# Altium project HealthSensors.PrjPcb
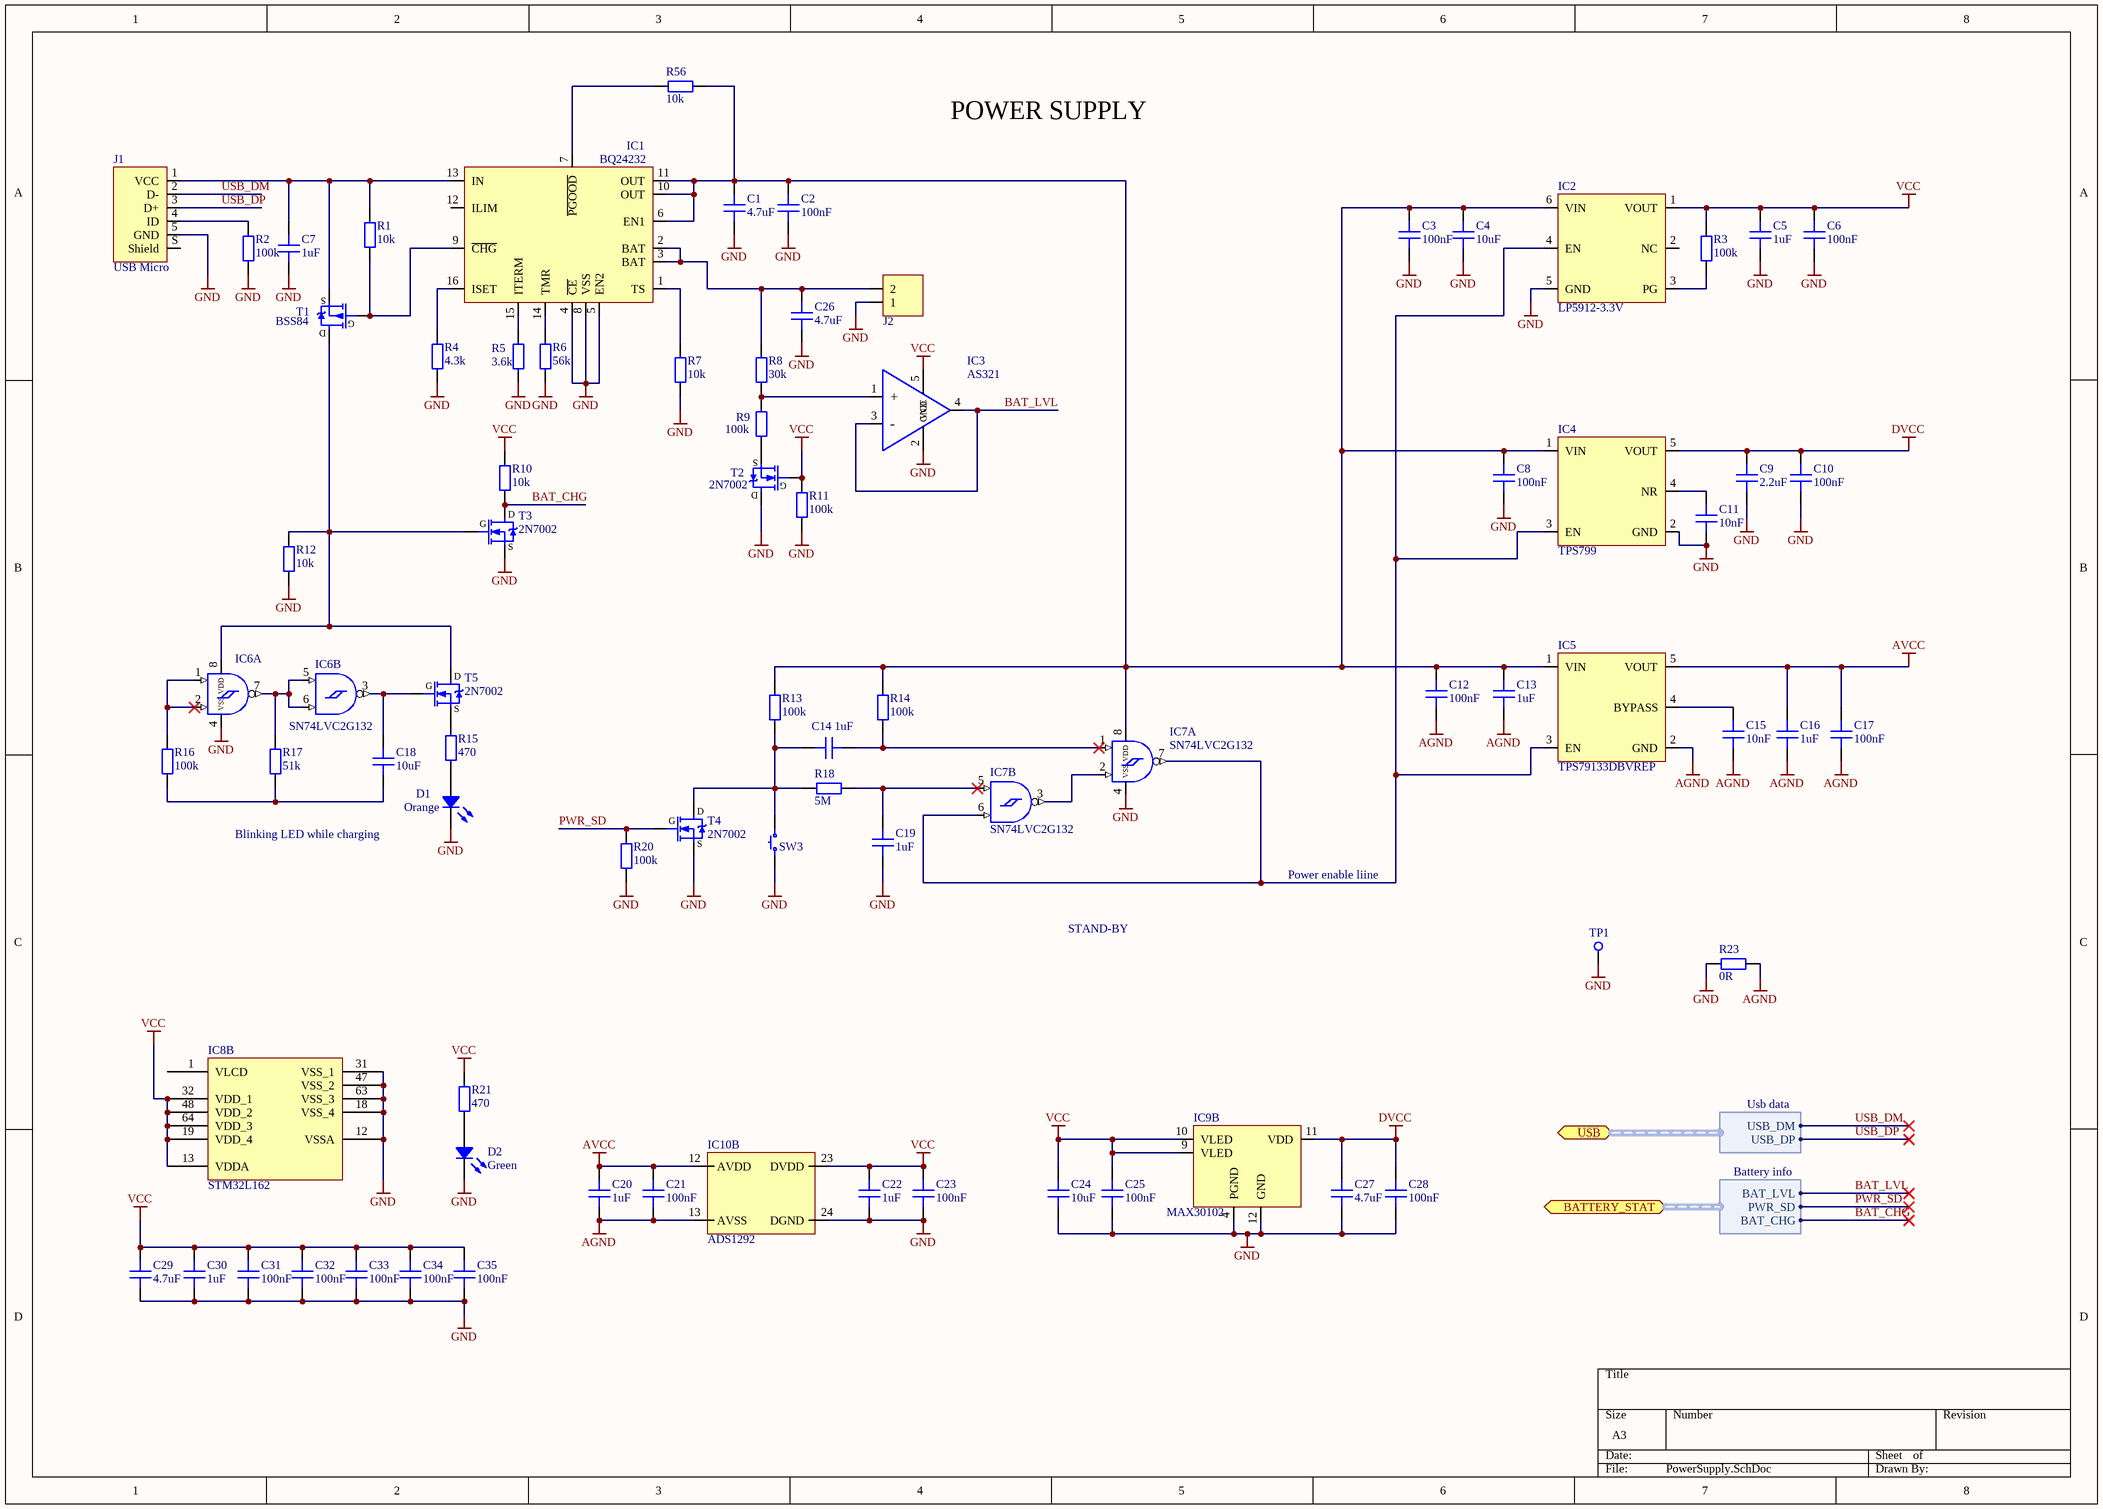
[diagram p0: PowerSupply.SchDoc]
4 sheets, 154 parts. Net scope: flat (ports and power ports of the same name join across sheets).
Board file: HealthSensors.PcbDoc
Sheets:
  PowerSupply.SchDoc
  ControlUnit.SchDoc
  Measurements.SchDoc
  Wireless.SchDoc

## Sheet PowerSupply.SchDoc
size A3

### Parts
C1  4.7uF  [CAP 0603]
C2  100nF  [CAP 0603]
C3  100nF  [CAP 0603]
C4  10uF  [CAP 0603]
C5  1uF  [CAP 0603]
C6  100nF  [CAP 0603]
C7  1uF  [CAP 0603]
C8  100nF  [CAP 0603]
C9  2.2uF  [CAP 0603]
C10  100nF  [CAP 0603]
C11  10nF  [CAP 0603]
C12  100nF  [CAP 0603]
C13  1uF  [CAP 0603]
C14  1uF  [CAP 0603]
C15  10nF  [CAP 0603]
C16  1uF  [CAP 0603]
C17  100nF  [CAP 0603]
C18  10uF  [CAP 0603]
C19  1uF  [CAP 0603]
C20  1uF  [CAP 0603]
C21  100nF  [CAP 0603]
C22  1uF  [CAP 0603]
C23  100nF  [CAP 0603]
C24  10uF  [CAP 0603]
C25  100nF  [CAP 0603]
C26  4.7uF  [CAP 0603]
C27  4.7uF  [CAP 0603]
C28  100nF  [CAP 0603]
C29  4.7uF  [CAP 0603]
C30  1uF  [CAP 0603]
C31  100nF  [CAP 0603]
C32  100nF  [CAP 0603]
C33  100nF  [CAP 0603]
C34  100nF  [CAP 0603]
C35  100nF  [CAP 0603]
D1  Orange  [LED 0603]
D2  Green  [LED 0603]
IC1  BQ24232  [QFN16]
IC2  LP5912-3.3V  [WSON 6]
IC3  AS321  [SOT23, 5-Leads]
IC4  TPS799  [SOT23, 5-Leads]
IC5  TPS79133DBVREP  [SOT23, 5-Leads]
IC6  SN74LVC2G132  [TSSOP8]  (parts A,B of 2)
IC7  SN74LVC2G132  [TSSOP8]  (parts A,B of 2)
IC8  STM32L162  [LQFP64_L]  (part B of 3)
IC9  MAX30102  [MAX30102]  (part B of 2)
IC10  ADS1292  [TQFP40]  (part B of 2)
J1  USB Micro  [FCI USB 10118193-0001LF]
J2  2 pin  [HDR 1x2 2.54]  (value not drawn)
R1  10k  [RES 0603]
R2  100k  [RES 0603]
R3  100k  [RES 0603]
R4  4.3k  [RES 0603]
R5  3.6k  [RES 0603]
R6  56k  [RES 0603]
R7  10k  [RES 0603]
R8  30k  [RES 0603]
R9  100k  [RES 0603]
R10  10k  [RES 0603]
R11  100k  [RES 0603]
R12  10k  [RES 0603]
R13  100k  [RES 0603]
R14  100k  [RES 0603]
R15  470  [RES 0603]
R16  100k  [RES 0603]
R17  51k  [RES 0603]
R18  5M  [RES 0603]
R20  100k  [RES 0603]
R21  470  [RES 0603]
R23  0R  [RES 0603]
R56  10k  [RES 0603]
SW3  BUTTON-NO  [SW OMRON]  (value not drawn)
T1  BSS84  [SOT23]
T2  2N7002  [SOT23]
T3  2N7002  [SOT23]
T4  2N7002  [SOT23]
T5  2N7002  [SOT23]
TP1  Test Point  [TP THT 48MILS]  (value not drawn)

### Ports
BATTERY_STAT (harness Battery info), USB (harness Usb data)

### Harnesses
Battery info: BAT_LVL, PWR_SD, BAT_CHG
Usb data: USB_DM, USB_DP

### Nets
AGND: C12.1 C13.1 C15.1 C16.1 C17.1 C20.1 C21.1 IC5.2(GND) IC10.13(AVSS) R23.1
AVCC: C16.2 C17.2 C20.2 C21.2 IC5.5(VOUT) IC10.12(AVDD)
DVCC: C9.2 C10.2 C27.2 C28.2 IC4.5(VOUT) IC9.11(VDD)
GND: C1.1 C2.1 C3.1 C4.1 C5.1 C6.1 C7.1 C8.1 C9.1 C10.1 C11.1 C19.1 C22.1 C23.1 C24.1 C25.1 C26.1 C27.1 C28.1 C29.1 C30.1 C31.1 C32.1 C33.1 C34.1 C35.1 D1.2 D2.2 IC1.4(~{CE}) IC1.5(EN2) IC1.8(VSS) IC2.5(GND) IC3.2(GND) IC4.2(GND) IC6.4(VSS) IC7.4(VSS) IC8.12(VSSA) IC8.18(VSS_4) IC8.31(VSS_1) IC8.47(VSS_2) IC8.63(VSS_3) IC9.4(PGND) IC9.12(GND) IC10.24(DGND) J1.5(GND) J2.1 R2.1 R4.1 R5.1 R6.1 R7.1 R11.1 R12.1 R20.1 R23.2 SW3.2 T2.3(D) T3.2(S) T4.2(S) TP1.1(TP)
VCC: C5.2 C6.2 C22.2 C23.2 C24.2 C25.2 C29.2 C30.2 C31.2 C32.2 C33.2 C34.2 C35.2 IC2.1(VOUT) IC3.5(VCC) IC8.13(VDDA) IC8.19(VDD_4) IC8.32(VDD_1) IC8.48(VDD_2) IC8.64(VDD_3) IC9.9(VLED) IC9.10(VLED) IC10.23(DVDD) R3.2 R10.2 R11.2 R21.2 T2.1(G)
BAT_CHG: R10.1 T3.3(D) ; port BATTERY_STAT.BAT_CHG
BAT_LVL: IC3.3(-) IC3.4(OUT) ; port BATTERY_STAT.BAT_LVL
PWR_SD: R20.2 T4.1(G) ; port BATTERY_STAT.PWR_SD
USB_DM: J1.2(D-) ; port USB.USB_DM
USB_DP: J1.3(D+) ; port USB.USB_DP
NetC1_2: C1.2 C2.2 C3.2 C4.2 C8.2 C12.2 C13.2 IC1.6(EN1) IC1.10(OUT) IC1.11(OUT) IC2.6(VIN) IC4.1(VIN) IC5.1(VIN) IC7.8(VDD) R13.2 R14.2 R56.2
NetC7_2: C7.2 IC1.13(IN) J1.1(VCC) R1.2 T1.3(S)
NetC11_2: C11.2 IC4.4(NR)
NetC14_1: C14.1 R13.1 R18.2 SW3.1 T4.3(D)
NetC14_2: C14.2 IC7.1(A) R14.1
NetC15_2: C15.2 IC5.4(BYPASS)
NetC18_1: C18.1 R16.1 R17.1
NetC18_2: C18.2 IC6.3(Y) T5.1(G)
NetC19_2: C19.2 IC7.5(A) R18.1
NetC26_2: C26.2 IC1.2(BAT) IC1.3(BAT) J2.2 R8.2
NetD1_1: D1.1 R15.1
NetD2_1: D2.1 R21.1
NetIC1_1: IC1.1(TS) R7.2
NetIC1_7: IC1.7(~{PGOOD}) R56.1
NetIC1_9: IC1.9(~{CHG}) R1.1 T1.1(G)
NetIC1_14: IC1.14(TMR) R6.2
NetIC1_15: IC1.15(ITERM) R5.2
NetIC1_16: IC1.16(ISET) R4.2
NetIC2_3: IC2.3(PG) R3.1
NetIC2_4: IC2.4(EN) IC4.3(EN) IC5.3(EN) IC7.6(B) IC7.7(Y)
NetIC3_1: IC3.1(+) R8.1 R9.2
NetIC6_1: IC6.1(A) IC6.2(B) R16.2
NetIC6_5: IC6.5(A) IC6.6(B) IC6.7(Y) R17.2
NetIC6_8: IC6.8(VDD) R12.2 T1.2(D) T3.1(G) T5.3(D)
NetIC7_2: IC7.2(B) IC7.3(Y)
NetJ1_4: J1.4(ID) R2.2
NetR9_1: R9.1 T2.2(S)
NetR15_2: R15.2 T5.2(S)

Not connected (* = marked no-connect by the designer): IC1 12(ILIM); IC2 2(NC); IC8 1(VLCD); J1 S(Shield)

### Notes on the sheet
- POWER SUPPLY
- Blinking LED while charging
- Power enable liine
- STAND-BY

### Library data of the parts
C1-C35 = Capacitor: SMT Capacitor
  C1 C26 C27 C29: Value: 4.7uF
  C2 C3 C6 C8 C10 C12 C17 C21 C23 C25 C28 C31-C35: Value: 100nF
  C4 C18 C24: Value: 10uF
  C5 C7 C13 C14 C16 C19 C20 C22 C30: Value: 1uF
  C9: Value: 2.2uF
  C11 C15: Value: 10nF
D1 D2 = LED: Chip LED
  D1: Value: Orange
  D2: Value: Green
IC1 = TI BQ24232: USB Friendly 0.5A Li+ Charger w/ Dynamic Power Management
IC2 = TI LP5912-3.3V: 50 mA, 3 V TO 50 V, MICROPOWER, LOW-DROPOUT LINEAR REGULATOR
IC3 = AS321: Op amp
IC4 = TI TPS799: TPS799 200-mA, Low-Quiescent Current, Ultralow Noise, High-PSRR Low-Dropout Linear  Regulator
IC5 = TI TPS79133DBVREP: ULTRALOW NOISE, HIGH PSRR, FAST RF, 100-mA  LOW-DROPOUT LINEAR REGULATORS
IC6 IC7 = SN74LVC2G132: Dual 2-Input NAND Gate With Schmitt-Trigger Inputs; Value: SN74LVC2G132
IC8 = STM32L162: STM32 ARM-based 32-bit MCU with 32 Kbytes Flash, 64-pin LQFP; Value: STM32L162RDT; ComponentLink1Description: http://www.st.com/content/ccc/resource/technical/document/datasheet/ee/d5/84/2b/a9/ae/44/3d/DM00039232.pdf/files/DM00039232.pdf/jcr:content/translations/en.DM00039232.pdf; ComponentLink1URL: http://www.st.com/stonline/products/literature/ds/13586.pdf; Package: LQFP64
IC9 = MAX30102: Pulse Oximeter and Heart-Rate Sensor
IC10 = ADS1292IRSMT: ADS1292IRSMT Analog Front End - AFE Cmplt Lw Pwr Intgrtd AFE for ECG apps; Manufacture: Texas Instruments; SNR - Signal to Noise Ratio: 107 dB; Package/Cas: VQFN-32; Supply Voltage - Min - Max: 2.7V - 5.25V; Operating Supply Curren: 750 uA; Operating Supply Voltage: 1.7 V to 3.6 V, 2.7 V to 5.25 V; Product Category: Analog Front End - AFE; Series: ADS1292; DatasheetURL: http://www.ti.com/lit/ds/symlink/ads1292.pdf; StoreURL: http://pl.mouser.com/Search/ProductDetail.aspx?R=ADS1292IRSMTvirtualkey59500000virtualkey595-ADS1292IRSMT
J1 = USB 2.0 Type B Micro: Micro usb
J2 = 2 pin: 2 pin header, male
R1-R18 R20 R21 R23 R56 = Resistor: SMDResistor
  R1 R7 R10 R12 R56: Value: 10k
  R2 R3 R9 R11 R13 R14 R16 R20: Value: 100k
  R4: Value: 4.3k
  R5: Value: 3.6k
  R6: Value: 56k
  R8: Value: 30k
  R15 R21: Value: 470
  R17: Value: 51k
  R18: Value: 5M
  R23: Value: 0R
SW3 = BUTTON-NO 2 PIN Small: Button, SMD, Small, 2.5x3mm
T1 = P-MOSFET: Unipolar transistor P-MOSFET; Value: BSS84
T2-T5 = N-MOSFET: Unipolar transistor N-MOSFET; Value: 2N7002

## Sheet ControlUnit.SchDoc
size A4
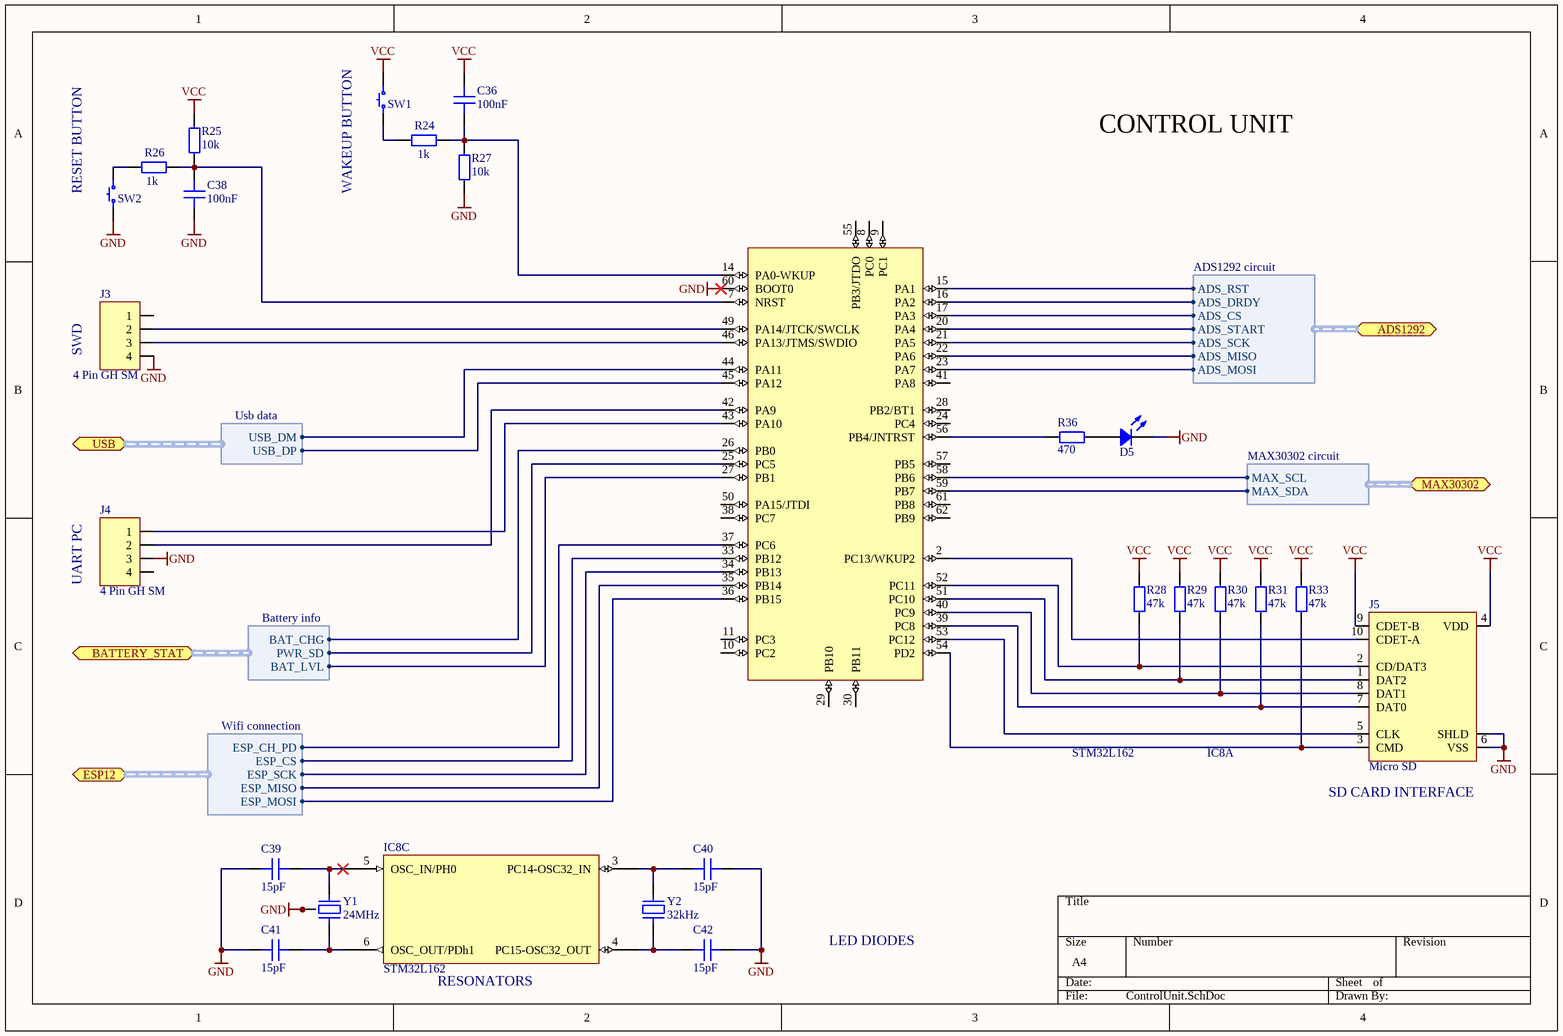
[diagram p1: ControlUnit.SchDoc]

### Parts
C36  100nF  [CAP 0603]
C38  100nF  [CAP 0603]
C39  15pF  [CAP 0603]
C40  15pF  [CAP 0603]
C41  15pF  [CAP 0603]
C42  15pF  [CAP 0603]
D5  Green  [LED 0603]  (value not drawn)
IC8  STM32L162  [LQFP64_L]  (parts A,C of 3)
J3  4 Pin GH SM  [SM04B]
J4  4 Pin GH SM  [SM04B]
J5  Micro SD  [HIROSE DM3AT-SF-PEJM5]
R24  1k  [RES 0603]
R25  10k  [RES 0603]
R26  1k  [RES 0603]
R27  10k  [RES 0603]
R28  47k  [RES 0603]
R29  47k  [RES 0603]
R30  47k  [RES 0603]
R31  47k  [RES 0603]
R33  47k  [RES 0603]
R36  470  [RES 0603]
SW1  BUTTON-NO  [SW OMRON]  (value not drawn)
SW2  BUTTON-NO  [SW OMRON]  (value not drawn)
Y1  24MHz  [RESONATOR ILCX13]
Y2  32kHz  [RESONATOR CFPX–217]

### Ports
ADS1292 (harness ADS1292 circuit), BATTERY_STAT (harness Battery info), ESP12 (harness Wifi connection), MAX30302 (harness MAX30302 circuit), USB (harness Usb data)

### Harnesses
ADS1292 circuit: ADS_RST, ADS_DRDY, ADS_CS, ADS_START, ADS_SCK, ADS_MISO, ADS_MOSI
Usb data: USB_DM, USB_DP
Battery info: BAT_LVL, PWR_SD, BAT_CHG
Wifi connection: ESP_CH_PD, ESP_CS, ESP_SCK, ESP_MISO, ESP_MOSI
MAX30302 circuit: MAX_SCL, MAX_SDA

### Nets
GND: C38.1 C39.1 C40.1 C41.1 C42.1 D5.2 IC8.60(BOOT0) J3.4 J4.3 J5.6(VSS) J5.S(SHLD) R27.1 SW2.2 Y1.2 Y1.4
VCC: C36.2 J5.4(VDD) J5.9(CDET-B) R25.2 R28.1 R29.1 R30.1 R31.1 R33.1 SW1.1
BAT_CHG: IC8.26(PB0) ; port BATTERY_STAT.BAT_CHG
BAT_LVL: IC8.27(PB1) ; port BATTERY_STAT.BAT_LVL
PWR_SD: IC8.25(PC5) ; port BATTERY_STAT.PWR_SD
USB_DM: IC8.44(PA11) ; port USB.USB_DM
USB_DP: IC8.45(PA12) ; port USB.USB_DP
NetC36_1: C36.1 IC8.14(PA0-WKUP) R24.1 R27.2
NetC38_2: C38.2 IC8.7(NRST) R25.1 R26.1
NetC39_2: C39.2 IC8.5(OSC_IN/PH0) Y1.1
NetC40_2: C40.2 IC8.3(PC14-OSC32_IN) Y2.2
NetC41_2: C41.2 IC8.6(OSC_OUT/PDh1) Y1.3
NetC42_2: C42.2 IC8.4(PC15-OSC32_OUT) Y2.1
NetD5_1: D5.1 R36.1
NetIC8_2: IC8.2(PC13/WKUP2) J5.10(CDET-A)
NetIC8_15: IC8.15(PA1) ; port ADS1292.ADS_RST
NetIC8_16: IC8.16(PA2) ; port ADS1292.ADS_DRDY
NetIC8_17: IC8.17(PA3) ; port ADS1292.ADS_CS
NetIC8_20: IC8.20(PA4) ; port ADS1292.ADS_START
NetIC8_21: IC8.21(PA5) ; port ADS1292.ADS_SCK
NetIC8_22: IC8.22(PA6) ; port ADS1292.ADS_MISO
NetIC8_23: IC8.23(PA7) ; port ADS1292.ADS_MOSI
NetIC8_33: IC8.33(PB12) ; port ESP12.ESP_CS
NetIC8_34: IC8.34(PB13) ; port ESP12.ESP_SCK
NetIC8_35: IC8.35(PB14) ; port ESP12.ESP_MISO
NetIC8_36: IC8.36(PB15) ; port ESP12.ESP_MOSI
NetIC8_37: IC8.37(PC6) ; port ESP12.ESP_CH_PD
NetIC8_39: IC8.39(PC8) J5.7(DAT0) R31.2
NetIC8_40: IC8.40(PC9) J5.8(DAT1) R30.2
NetIC8_42: IC8.42(PA9) J4.2
NetIC8_43: IC8.43(PA10) J4.1
NetIC8_46: IC8.46(PA13/JTMS/SWDIO) J3.3
NetIC8_49: IC8.49(PA14/JTCK/SWCLK) J3.2
NetIC8_51: IC8.51(PC10) J5.1(DAT2) R29.2
NetIC8_52: IC8.52(PC11) J5.2(CD/DAT3) R28.2
NetIC8_53: IC8.53(PC12) J5.5(CLK)
NetIC8_54: IC8.54(PD2) J5.3(CMD) R33.2
NetIC8_56: IC8.56(PB4/JNTRST) R36.2
NetIC8_58: IC8.58(PB6) ; port MAX30302.MAX_SCL
NetIC8_59: IC8.59(PB7) ; port MAX30302.MAX_SDA
NetR24_2: R24.2 SW1.2
NetR26_2: R26.2 SW2.1

Not connected (* = marked no-connect by the designer): IC8 8(PC0) 9(PC1) 10(PC2) 11(PC3) 24(PC4) 28(PB2/BT1) 29(PB10) 30(PB11) 38(PC7) 41(PA8) 50(PA15/JTDI) 55(PB3/JTDO) 57(PB5) 61(PB8) 62(PB9); J3 1; J4 4

### Notes on the sheet
- CONTROL UNIT
- (near SW2) RESET BUTTON
- (near SW1) WAKEUP BUTTON
- SWD
- UART PC
- (near J5) SD CARD INTERFACE
- (near IC8) RESONATORS
- LED DIODES

### Library data of the parts
C36 C38-C42 = Capacitor: SMT Capacitor
  C36 C38: Value: 100nF
  C39-C42: Value: 15pF
D5 = LED: Chip LED; Value: Green
IC8 = STM32L162: as IC8 on sheet PowerSupply; ComponentLink1Description: http://www.st.com/content/ccc/resource/technical/document/datasheet/ee/d5/84/2b/a9/ae/44/3d/DM00039232.pdf/files/DM00039232.pdf/jcr:content/translations/en.DM00039232.pdf; ComponentLink1URL: http://www.st.com/stonline/products/literature/ds/13586.pdf; Package: LQFP64
J3 J4 = 4 Pin GH SM: Złącze GH, męskie, poziome, 4 piny, SMD
J5 = Hirose DM3 MicroSD: Micro sd card slot
R24-R31 R33 R36 = Resistor: SMDResistor
  R24 R26: Value: 1k
  R25 R27: Value: 10k
  R28-R31 R33: Value: 47k
  R36: Value: 470
SW1 SW2 = BUTTON-NO 2 PIN Small: Button, SMD, Small, 2.5x3mm
Y1 = Resonator (4pin): Resonator
Y2 = Resonator

## Sheet Measurements.SchDoc: Measurement circuits
size A3; Author: Kajetan Śpionek
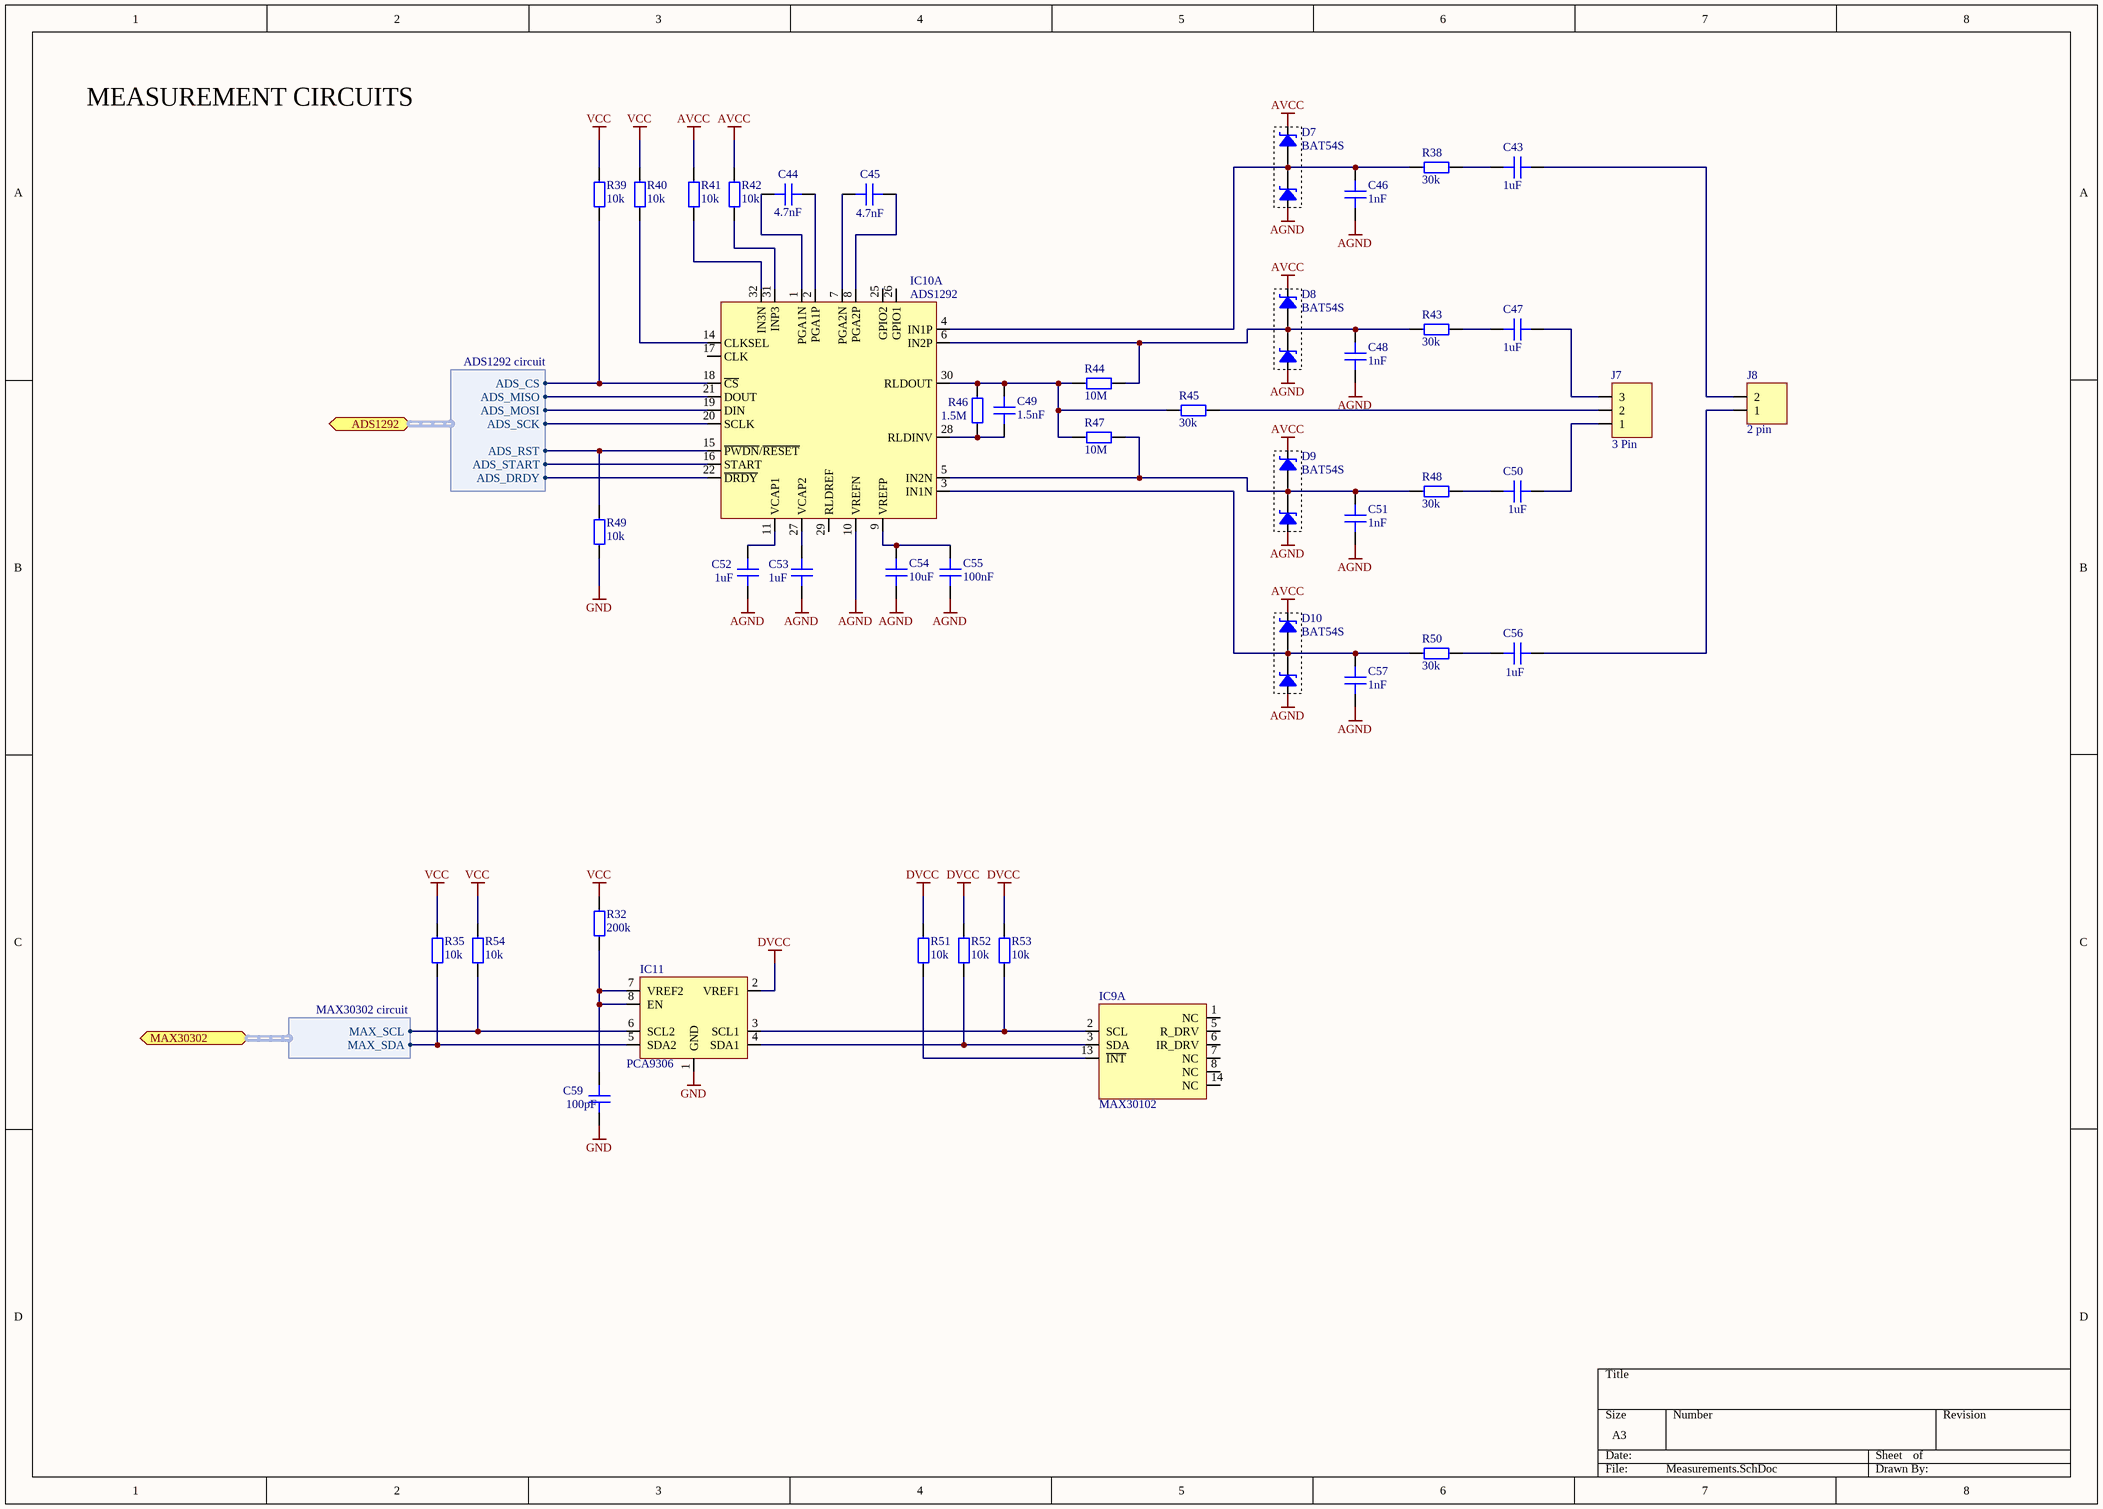
[diagram p2: Measurements.SchDoc]

### Parts
C43  1uF  [CAP 0603]
C44  4.7nF  [CAP 0603]
C45  4.7nF  [CAP 0603]
C46  1nF  [CAP 0603]
C47  1uF  [CAP 0603]
C48  1nF  [CAP 0603]
C49  1.5nF  [CAP 0603]
C50  1uF  [CAP 0603]
C51  1nF  [CAP 0603]
C52  1uF  [CAP 0603]
C53  1uF  [CAP 0603]
C54  10uF  [CAP 0603]
C55  100nF  [CAP 0603]
C56  1uF  [CAP 0603]
C57  1nF  [CAP 0603]
C59  100pF  [CAP 0603]
D7  BAT54S  [SOT23]
D8  BAT54S  [SOT23]
D9  BAT54S  [SOT23]
D10  BAT54S  [SOT23]
IC9  MAX30102  [MAX30102]  (part A of 2)
IC10  ADS1292  [TQFP40]  (part A of 2)
IC11  PCA9306  [SSOP8]
J7  3 Pin  [HDR 1x3 2.54]
J8  2 pin  [HDR 1x2 2.54]
R32  200k  [RES 0603]
R35  10k  [RES 0603]
R38  30k  [RES 0603]
R39  10k  [RES 0603]
R40  10k  [RES 0603]
R41  10k  [RES 0603]
R42  10k  [RES 0603]
R43  30k  [RES 0603]
R44  10M  [RES 0603]
R45  30k  [RES 0603]
R46  1.5M  [RES 0603]
R47  10M  [RES 0603]
R48  30k  [RES 0603]
R49  10k  [RES 0603]
R50  30k  [RES 0603]
R51  10k  [RES 0603]
R52  10k  [RES 0603]
R53  10k  [RES 0603]
R54  10k  [RES 0603]

### Ports
ADS1292 (harness ADS1292 circuit), MAX30302 (harness MAX30302 circuit)

### Harnesses
ADS1292 circuit: ADS_RST, ADS_DRDY, ADS_CS, ADS_START, ADS_SCK, ADS_MISO, ADS_MOSI
MAX30302 circuit: MAX_SCL, MAX_SDA

### Nets
AGND: C46.1 C48.1 C51.1 C52.1 C53.1 C54.1 C55.1 C57.1 D7.1 D8.1 D9.1 D10.1 IC10.10(VREFN)
AVCC: D7.2 D8.2 D9.2 D10.2 R41.2 R42.2
DVCC: IC11.2(VREF1) R51.2 R52.2 R53.2
GND: C59.1 IC11.1(GND) R49.1
VCC: R32.2 R35.2 R39.2 R40.2 R54.2
NetC43_1: C43.1 J8.2
NetC43_2: C43.2 R38.1
NetC44_1: C44.1 IC10.1(PGA1N)
NetC44_2: C44.2 IC10.2(PGA1P)
NetC45_1: C45.1 IC10.7(PGA2N)
NetC45_2: C45.2 IC10.8(PGA2P)
NetC46_2: C46.2 D7.3 IC10.4(IN1P) R38.2
NetC47_1: C47.1 J7.3
NetC47_2: C47.2 R43.1
NetC48_2: C48.2 D8.3 IC10.6(IN2P) R43.2 R44.1
NetC49_1: C49.1 IC10.28(RLDINV) R46.1
NetC49_2: C49.2 IC10.30(RLDOUT) R44.2 R45.2 R46.2 R47.2
NetC50_1: C50.1 J7.1
NetC50_2: C50.2 R48.1
NetC51_2: C51.2 D9.3 IC10.5(IN2N) R47.1 R48.2
NetC52_2: C52.2 IC10.11(VCAP1)
NetC53_2: C53.2 IC10.27(VCAP2)
NetC54_2: C54.2 C55.2 IC10.9(VREFP)
NetC56_1: C56.1 J8.1
NetC56_2: C56.2 R50.1
NetC57_2: C57.2 D10.3 IC10.3(IN1N) R50.2
NetC59_2: C59.2 IC11.7(VREF2) IC11.8(EN) R32.1
NetIC8_15: IC10.15(~{PWDN}/~{RESET}) R49.2 ; port ADS1292.ADS_RST
NetIC8_16: IC10.22(~{DRDY}) ; port ADS1292.ADS_DRDY
NetIC8_17: IC10.18(~{CS}) R39.1 ; port ADS1292.ADS_CS
NetIC8_20: IC10.16(START) ; port ADS1292.ADS_START
NetIC8_21: IC10.20(SCLK) ; port ADS1292.ADS_SCK
NetIC8_22: IC10.21(DOUT) ; port ADS1292.ADS_MISO
NetIC8_23: IC10.19(DIN) ; port ADS1292.ADS_MOSI
NetIC8_58: IC11.6(SCL2) R54.1 ; port MAX30302.MAX_SCL
NetIC8_59: IC11.5(SDA2) R35.1 ; port MAX30302.MAX_SDA
NetIC9_2: IC9.2(SCL) IC11.3(SCL1) R53.1
NetIC9_3: IC9.3(SDA) IC11.4(SDA1) R52.1
NetIC9_13: IC9.13(~{INT}) R51.1
NetIC10_14: IC10.14(CLKSEL) R40.1
NetIC10_31: IC10.31(INP3) R42.1
NetIC10_32: IC10.32(IN3N) R41.1
NetJ7_2: J7.2 R45.1

Not connected (* = marked no-connect by the designer): IC9 1(NC) 5(R_DRV) 6(IR_DRV) 7(NC) 8(NC) 14(NC); IC10 17(CLK) 25(GPIO2) 26(GPIO1) 29(RLDREF)

### Notes on the sheet
- MEASUREMENT CIRCUITS

### Library data of the parts
C43-C57 C59 = Capacitor: SMT Capacitor
  C43 C47 C50 C52 C53 C56: Value: 1uF
  C44 C45: Value: 4.7nF
  C46 C48 C51 C57: Value: 1nF
  C49: Value: 1.5nF
  C54: Value: 10uF
  C55: Value: 100nF
  C59: Value: 100pF
D7-D10 = BAT54S: Schottky barrier diodes; Value: BAT54S
IC9 = MAX30102: Pulse Oximeter and Heart-Rate Sensor
IC10 = ADS1292IRSMT: as IC10 on sheet PowerSupply; Product Category: Analog Front End - AFE; Series: ADS1292; DatasheetURL: http://www.ti.com/lit/ds/symlink/ads1292.pdf; StoreURL: http://pl.mouser.com/Search/ProductDetail.aspx?R=ADS1292IRSMTvirtualkey59500000virtualkey595-ADS1292IRSMT
IC11 = PCA9306: Dual Bidirectional I2C Bus and SMBus Voltage-Level Translator
J7 = 3 Pin: 3 pin header, male
J8 = 2 Pin: 2 pin header, male
R32 R35 R38-R54 = Resistor: SMDResistor
  R32: Value: 200k
  R35 R39-R42 R49 R51-R54: Value: 10k
  R38 R43 R45 R48 R50: Value: 30k
  R44 R47: Value: 10M
  R46: Value: 1.5M

## Sheet Wireless.SchDoc
size A
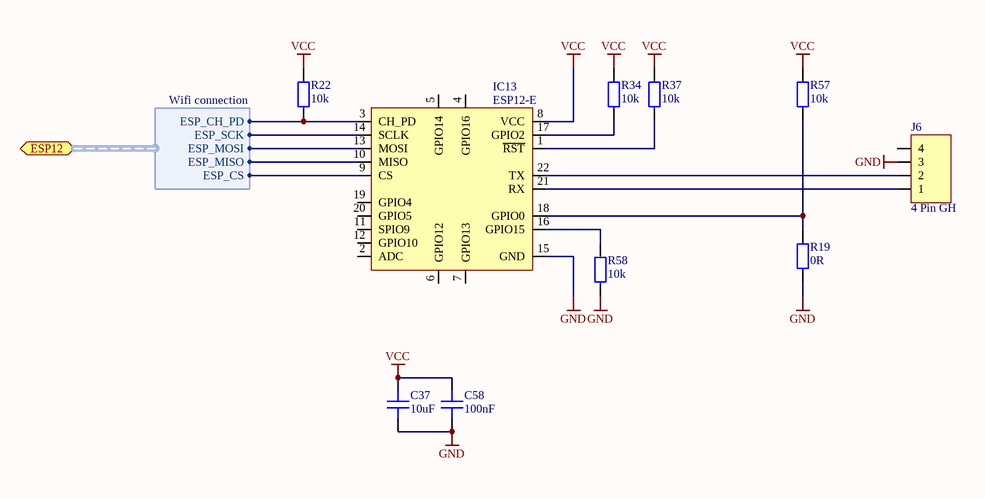
[diagram p3: Wireless.SchDoc]

### Parts
C37  10uF  [CAP 0603]
C58  100nF  [CAP 0603]
IC13  ESP12-E  [ESP8266 ESP-12-E]
J6  4 Pin GH  [BM04B]
R19  0R  [RES 0603]
R22  10k  [RES 0603]
R34  10k  [RES 0603]
R37  10k  [RES 0603]
R57  10k  [RES 0603]
R58  10k  [RES 0603]

### Ports
ESP12 (harness Wifi connection)

### Harnesses
Wifi connection: ESP_CH_PD, ESP_CS, ESP_SCK, ESP_MISO, ESP_MOSI

### Nets
GND: C37.1 C58.1 IC13.15(GND) J6.3 R19.1 R58.1
VCC: C37.2 C58.2 IC13.8(VCC) R22.2 R34.2 R37.2 R57.2
NetIC8_33: IC13.9(CS) ; port ESP12.ESP_CS
NetIC8_34: IC13.14(SCLK) ; port ESP12.ESP_SCK
NetIC8_35: IC13.10(MISO) ; port ESP12.ESP_MISO
NetIC8_36: IC13.13(MOSI) ; port ESP12.ESP_MOSI
NetIC8_37: IC13.3(CH_PD) R22.1 ; port ESP12.ESP_CH_PD
NetIC13_1: IC13.1(~{RST}) R37.1
NetIC13_16: IC13.16(GPIO15) R58.2
NetIC13_17: IC13.17(GPIO2) R34.1
NetIC13_18: IC13.18(GPIO0) R19.2 R57.1
NetIC13_21: IC13.21(RX) J6.1
NetIC13_22: IC13.22(TX) J6.2

Not connected (* = marked no-connect by the designer): IC13 2(ADC) 4(GPIO16) 5(GPIO14) 6(GPIO12) 7(GPIO13) 11(SPIO9) 12(GPIO10) 19(GPIO4) 20(GPIO5); J6 4

### Library data of the parts
C37 C58 = Capacitor: SMT Capacitor
  C37: Value: 10uF
  C58: Value: 100nF
IC13 = ESP-12E: Wifi module, esp12-e, based on ESP8266 chip
J6 = 4 Pin GH: Złącze GH, męskie, proste, 4 piny, SMD
R19 R22 R34 R37 R57 R58 = Resistor: SMDResistor
  R19: Value: 0R
  R22 R34 R37 R57 R58: Value: 10k

## Nets that join several sheets
AGND: PowerSupply (10 pins), Measurements (13 pins)
AVCC: PowerSupply (6 pins), Measurements (6 pins)
DVCC: PowerSupply (6 pins), Measurements (IC11.2 R51.2 R52.2 R53.2)
GND: PowerSupply (60 pins), ControlUnit (15 pins), Measurements (C59.1 IC11.1 R49.1), Wireless (6 pins)
VCC: PowerSupply (28 pins), ControlUnit (10 pins), Measurements (5 pins), Wireless (7 pins)
BAT_CHG: PowerSupply (R10.1 T3.3), ControlUnit (IC8.26)
BAT_LVL: PowerSupply (IC3.3 IC3.4), ControlUnit (IC8.27)
NetIC8_15: ControlUnit (IC8.15), Measurements (IC10.15 R49.2)
NetIC8_16: ControlUnit (IC8.16), Measurements (IC10.22)
NetIC8_17: ControlUnit (IC8.17), Measurements (IC10.18 R39.1)
NetIC8_20: ControlUnit (IC8.20), Measurements (IC10.16)
NetIC8_21: ControlUnit (IC8.21), Measurements (IC10.20)
NetIC8_22: ControlUnit (IC8.22), Measurements (IC10.21)
NetIC8_23: ControlUnit (IC8.23), Measurements (IC10.19)
NetIC8_33: ControlUnit (IC8.33), Wireless (IC13.9)
NetIC8_34: ControlUnit (IC8.34), Wireless (IC13.14)
NetIC8_35: ControlUnit (IC8.35), Wireless (IC13.10)
NetIC8_36: ControlUnit (IC8.36), Wireless (IC13.13)
NetIC8_37: ControlUnit (IC8.37), Wireless (IC13.3 R22.1)
NetIC8_58: ControlUnit (IC8.58), Measurements (IC11.6 R54.1)
NetIC8_59: ControlUnit (IC8.59), Measurements (IC11.5 R35.1)
PWR_SD: PowerSupply (R20.2 T4.1), ControlUnit (IC8.25)
USB_DM: PowerSupply (J1.2), ControlUnit (IC8.44)
USB_DP: PowerSupply (J1.3), ControlUnit (IC8.45)